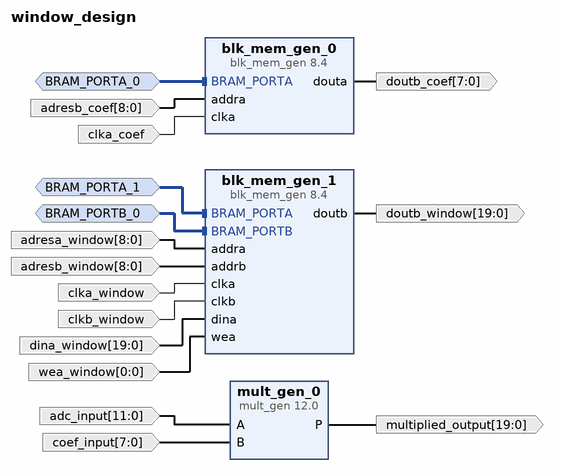
[diagram p0: block diagram of the top level]
# Vivado block design window_design, xc7a35tcpg236-1, Vivado 2022.1
create_bd_design window_design

create_bd_intf_port -mode Slave -vlnv xilinx.com:interface:bram_rtl:1.0 BRAM_PORTA_0
create_bd_intf_port -mode Slave -vlnv xilinx.com:interface:bram_rtl:1.0 BRAM_PORTA_1
create_bd_intf_port -mode Slave -vlnv xilinx.com:interface:bram_rtl:1.0 BRAM_PORTB_0
create_bd_port -dir I -from 8 -to 0 adresb_coef
create_bd_port -dir I -type clk clka_coef
create_bd_port -dir O -from 7 -to 0 doutb_coef
create_bd_port -dir I -from 11 -to 0 -type data adc_input
create_bd_port -dir I -from 7 -to 0 -type data coef_input
create_bd_port -dir O -from 19 -to 0 -type data multiplied_output
create_bd_port -dir I -from 8 -to 0 adresa_window
create_bd_port -dir I -type clk clka_window
create_bd_port -dir I -from 19 -to 0 dina_window
create_bd_port -dir I -from 8 -to 0 adresb_window
create_bd_port -dir I -type clk clkb_window
create_bd_port -dir O -from 19 -to 0 doutb_window
create_bd_port -dir I -from 0 -to 0 wea_window

create_bd_cell -type ip -vlnv xilinx.com:ip:blk_mem_gen:8.4 blk_mem_gen_0
set_property -dict [list \
  CONFIG.Coe_File ../../../../../../../../coee.coe \
  CONFIG.Enable_32bit_Address false \
  CONFIG.Enable_A Always_Enabled \
  CONFIG.Load_Init_File true \
  CONFIG.Memory_Type Single_Port_ROM \
  CONFIG.Port_A_Write_Rate 0 \
  CONFIG.Register_PortA_Output_of_Memory_Primitives true \
  CONFIG.Use_RSTA_Pin false \
  CONFIG.Write_Depth_A 512 \
  CONFIG.Write_Width_A 8 \
  CONFIG.use_bram_block Stand_Alone \
] [get_bd_cells blk_mem_gen_0]
create_bd_cell -type ip -vlnv xilinx.com:ip:mult_gen:12.0 mult_gen_0
set_property -dict [list \
  CONFIG.Multiplier_Construction Use_Mults \
  CONFIG.PipeStages 0 \
  CONFIG.PortAType Signed \
  CONFIG.PortAWidth 12 \
  CONFIG.PortBWidth 8 \
  CONFIG.Use_Custom_Output_Width false \
] [get_bd_cells mult_gen_0]
create_bd_cell -type ip -vlnv xilinx.com:ip:blk_mem_gen:8.4 blk_mem_gen_1
set_property -dict [list \
  CONFIG.Enable_32bit_Address false \
  CONFIG.Enable_A Always_Enabled \
  CONFIG.Enable_B Always_Enabled \
  CONFIG.Memory_Type Simple_Dual_Port_RAM \
  CONFIG.Operating_Mode_A NO_CHANGE \
  CONFIG.Port_A_Write_Rate 50 \
  CONFIG.Port_B_Clock 100 \
  CONFIG.Port_B_Enable_Rate 100 \
  CONFIG.Read_Width_B 20 \
  CONFIG.Register_PortB_Output_of_Memory_Primitives true \
  CONFIG.Use_Byte_Write_Enable false \
  CONFIG.Write_Depth_A 512 \
  CONFIG.Write_Width_A 20 \
  CONFIG.Write_Width_B 20 \
  CONFIG.use_bram_block Stand_Alone \
] [get_bd_cells blk_mem_gen_1]

# ---- connections ----

connect_bd_intf_net -intf_net BRAM_PORTA_0_1 [get_bd_intf_ports BRAM_PORTA_0] [get_bd_intf_pins blk_mem_gen_0/BRAM_PORTA]
connect_bd_intf_net -intf_net BRAM_PORTA_1_1 [get_bd_intf_ports BRAM_PORTA_1] [get_bd_intf_pins blk_mem_gen_1/BRAM_PORTA]
connect_bd_intf_net -intf_net BRAM_PORTB_0_1 [get_bd_intf_ports BRAM_PORTB_0] [get_bd_intf_pins blk_mem_gen_1/BRAM_PORTB]
connect_bd_net -net A_0_1 [get_bd_ports adc_input] [get_bd_pins mult_gen_0/A]
connect_bd_net -net B_0_1 [get_bd_ports coef_input] [get_bd_pins mult_gen_0/B]
connect_bd_net -net addra_0_1 [get_bd_ports adresb_coef] [get_bd_pins blk_mem_gen_0/addra]
connect_bd_net -net addra_0_2 [get_bd_ports adresa_window] [get_bd_pins blk_mem_gen_1/addra]
connect_bd_net -net addrb_0_1 [get_bd_ports adresb_window] [get_bd_pins blk_mem_gen_1/addrb]
connect_bd_net [get_bd_pins blk_mem_gen_0/douta] [get_bd_ports doutb_coef]
connect_bd_net [get_bd_pins blk_mem_gen_1/doutb] [get_bd_ports doutb_window]
connect_bd_net -net clka_0_1 [get_bd_ports clka_coef] [get_bd_pins blk_mem_gen_0/clka]
connect_bd_net -net clka_0_2 [get_bd_ports clka_window] [get_bd_pins blk_mem_gen_1/clka]
connect_bd_net -net clkb_0_1 [get_bd_ports clkb_window] [get_bd_pins blk_mem_gen_1/clkb]
connect_bd_net -net dina_0_1 [get_bd_ports dina_window] [get_bd_pins blk_mem_gen_1/dina]
connect_bd_net [get_bd_pins mult_gen_0/P] [get_bd_ports multiplied_output]
connect_bd_net -net wea_0_1 [get_bd_ports wea_window] [get_bd_pins blk_mem_gen_1/wea]

validate_bd_design
save_bd_design
